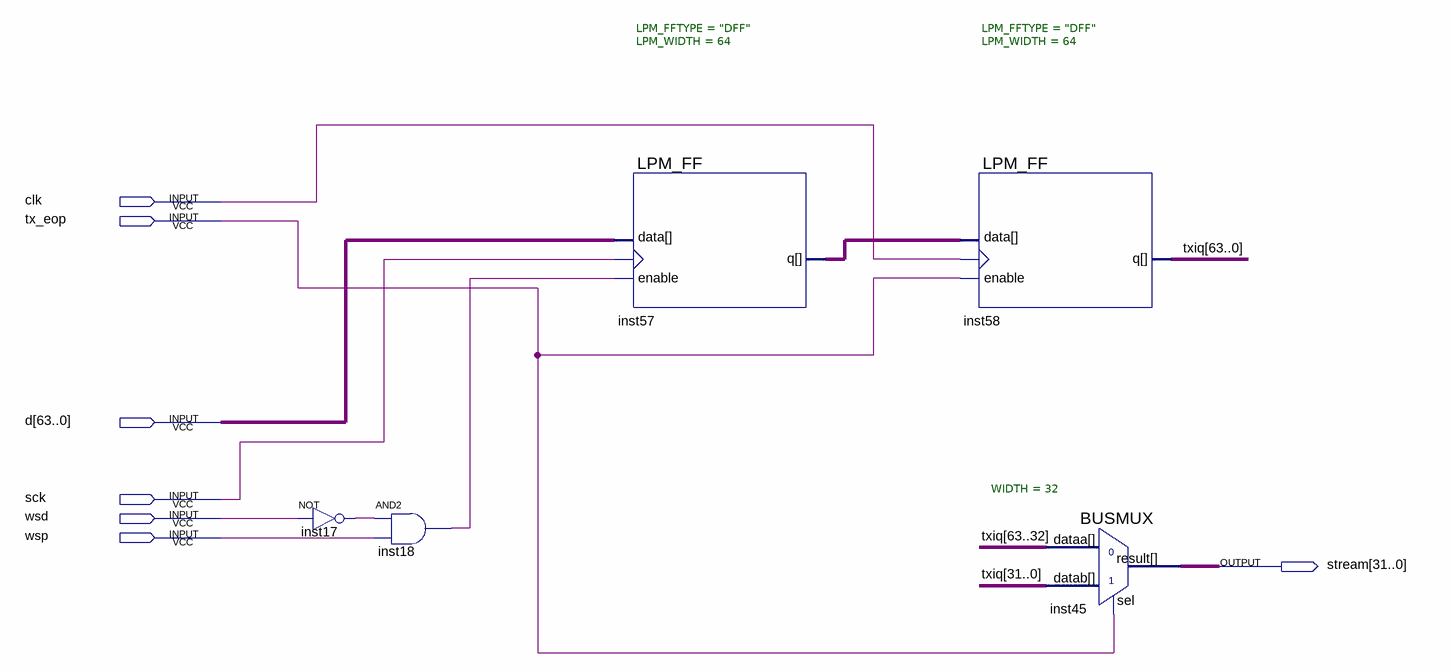
[diagram p0: schematic sheet]
// Quartus schematic i2s_to_avalon.bdf as structural Verilog: 5 symbols, 7 pins
module i2s_to_avalon (
  input  clk,
  input  tx_eop,
  input  [63:0] d,
  input  sck,
  input  wsd,
  input  wsp,
  output [31:0] stream
);

  wire inst17_out, inst18_out;
  wire [63:0] inst57_q, txiq;

  not inst17 (inst17_out, wsd);
  and inst18 (inst18_out, inst17_out, wsp);
  LPM_FF #(.LPM_FFTYPE("DFF"), .LPM_WIDTH(64)) inst57 (.enable(inst18_out), .clock(sck), .data(d), .q(inst57_q));
  LPM_FF #(.LPM_FFTYPE("DFF"), .LPM_WIDTH(64)) inst58 (.enable(tx_eop), .clock(clk), .data(inst57_q), .q(txiq));
  BUSMUX #(.WIDTH(32)) inst45 (.datab(txiq[31:0]), .sel(tx_eop), .dataa(txiq[63:32]), .result(stream));
endmodule
